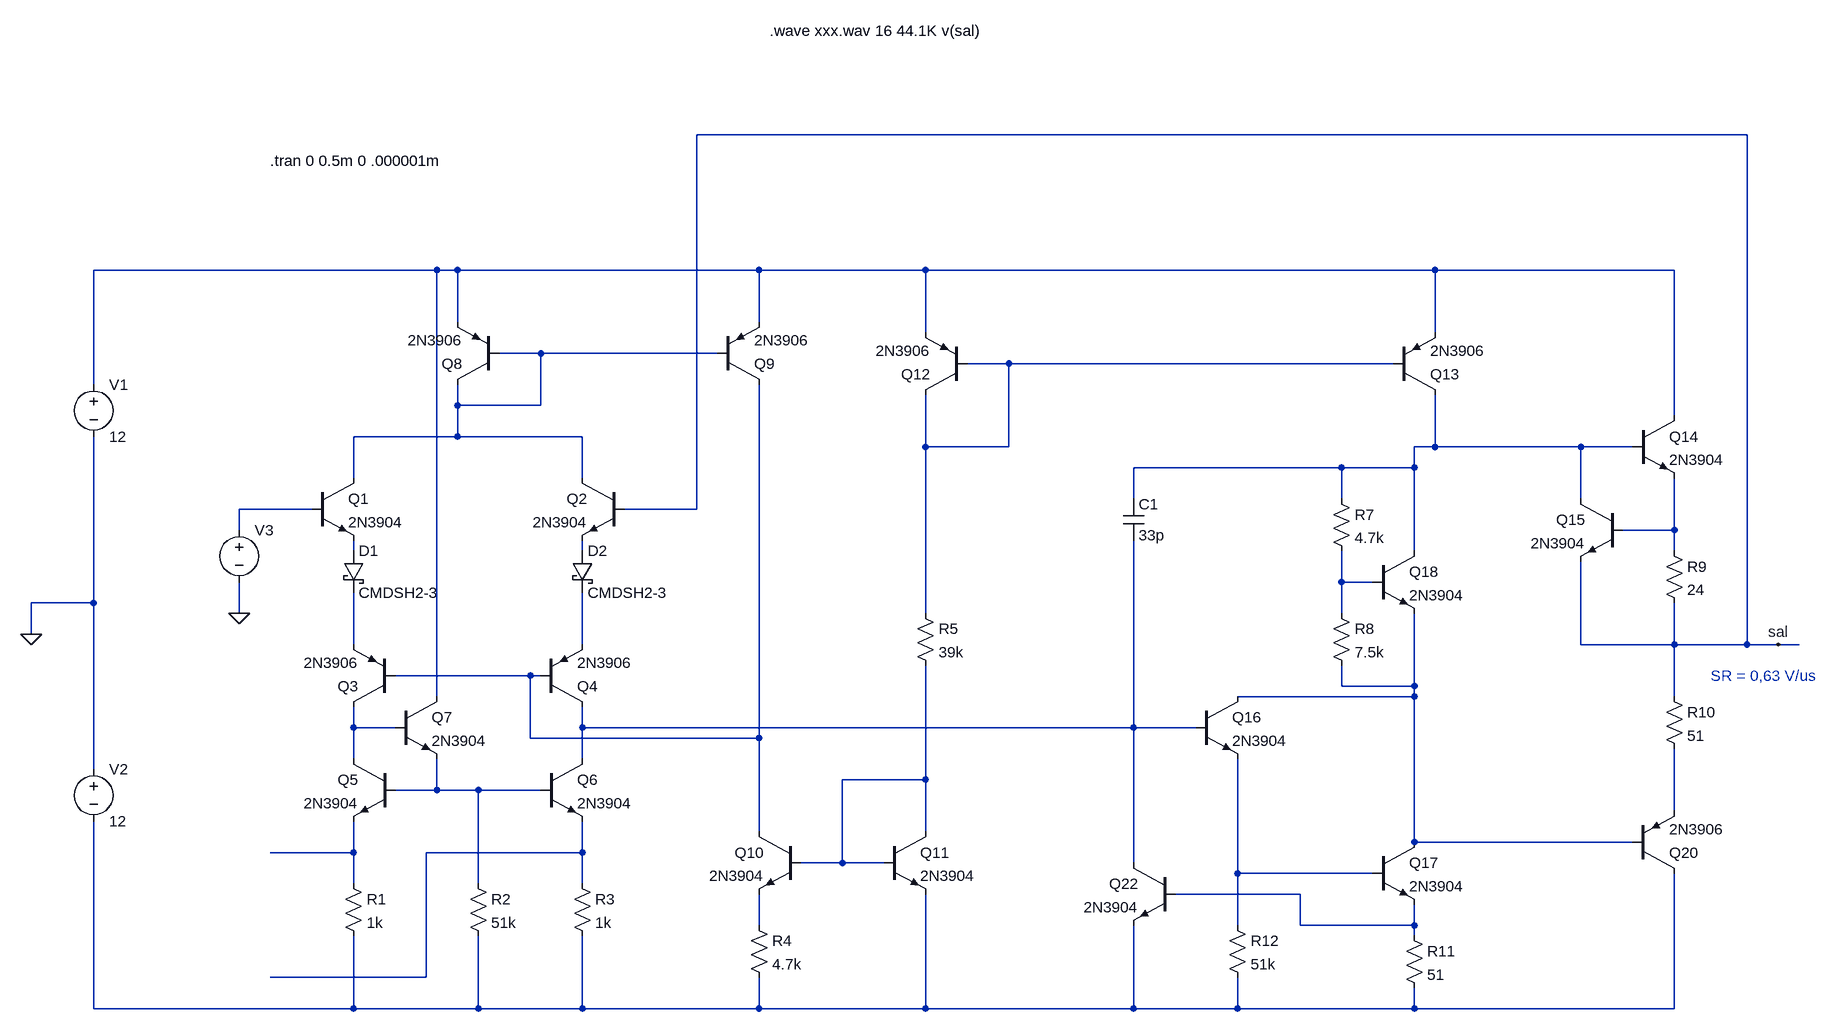
[diagram p0: schematic 741disc_sr.asc]
741disc_sr.asc, the LTspice schematic file:
Version 4
SHEET 1 2276 1496
WIRE 2144 -256 528 -256
WIRE 128 -48 -400 -48
WIRE 160 -48 128 -48
WIRE 624 -48 160 -48
WIRE 880 -48 624 -48
WIRE 1664 -48 880 -48
WIRE 2032 -48 1664 -48
WIRE 160 32 160 -48
WIRE 624 32 624 -48
WIRE 880 48 880 -48
WIRE 1664 48 1664 -48
WIRE 288 80 224 80
WIRE 560 80 288 80
WIRE 1008 96 944 96
WIRE 1600 96 1008 96
WIRE -400 128 -400 -48
WIRE 160 160 160 128
WIRE 288 160 288 80
WIRE 288 160 160 160
WIRE 2032 176 2032 -48
WIRE 160 208 160 160
WIRE 160 208 0 208
WIRE 352 208 160 208
WIRE 880 224 880 144
WIRE 1008 224 1008 96
WIRE 1008 224 880 224
WIRE 1664 224 1664 144
WIRE 1664 224 1632 224
WIRE 1888 224 1664 224
WIRE 1968 224 1888 224
WIRE 1520 256 1200 256
WIRE 1632 256 1632 224
WIRE 1632 256 1520 256
WIRE 0 272 0 208
WIRE 352 272 352 208
WIRE 1200 304 1200 256
WIRE 1520 304 1520 256
WIRE 1888 304 1888 224
WIRE -64 320 -176 320
WIRE 528 320 528 -256
WIRE 528 320 416 320
WIRE -176 352 -176 320
WIRE 2032 352 2032 272
WIRE 2032 352 1952 352
WIRE 0 384 0 368
WIRE 352 384 352 368
WIRE 1632 384 1632 256
WIRE 2032 384 2032 352
WIRE 1520 432 1520 384
WIRE 1568 432 1520 432
WIRE -400 464 -400 208
WIRE -400 464 -496 464
WIRE -176 480 -176 432
WIRE 880 480 880 224
WIRE 1520 480 1520 432
WIRE -496 512 -496 464
WIRE 0 528 0 448
WIRE 352 528 352 448
WIRE 1888 528 1888 400
WIRE 2032 528 2032 464
WIRE 2032 528 1888 528
WIRE 2144 528 2032 528
WIRE 2144 528 2144 -256
WIRE 2192 528 2144 528
WIRE 2224 528 2192 528
WIRE 272 576 64 576
WIRE 288 576 272 576
WIRE 1520 592 1520 560
WIRE 1632 592 1632 480
WIRE 1632 592 1520 592
WIRE 128 608 128 -48
WIRE 1632 608 1632 592
WIRE 1632 608 1360 608
WIRE 2032 608 2032 528
WIRE 0 656 0 624
WIRE 64 656 0 656
WIRE 352 656 352 624
WIRE 1200 656 1200 368
WIRE 1200 656 352 656
WIRE 1296 656 1200 656
WIRE 272 672 272 576
WIRE 624 672 624 128
WIRE 624 672 272 672
WIRE 0 704 0 656
WIRE 352 704 352 656
WIRE -400 720 -400 464
WIRE 880 736 880 560
WIRE 880 736 752 736
WIRE 128 752 128 704
WIRE 128 752 64 752
WIRE 192 752 128 752
WIRE 288 752 192 752
WIRE 2032 784 2032 688
WIRE 624 816 624 672
WIRE 880 816 880 736
WIRE 1632 832 1632 608
WIRE 1968 832 1632 832
WIRE 0 848 0 800
WIRE 0 848 -128 848
WIRE 352 848 352 800
WIRE 352 848 112 848
WIRE 752 864 752 736
WIRE 752 864 688 864
WIRE 816 864 752 864
WIRE 1200 864 1200 656
WIRE 1360 880 1360 704
WIRE 1568 880 1360 880
WIRE 0 896 0 848
WIRE 192 896 192 752
WIRE 352 896 352 848
WIRE 1456 912 1264 912
WIRE 624 960 624 912
WIRE 1360 960 1360 880
WIRE 1456 960 1456 912
WIRE 1632 960 1632 928
WIRE 1632 960 1456 960
WIRE 1632 976 1632 960
WIRE 112 1040 112 848
WIRE 112 1040 -128 1040
WIRE -400 1088 -400 800
WIRE 0 1088 0 976
WIRE 0 1088 -400 1088
WIRE 192 1088 192 976
WIRE 192 1088 0 1088
WIRE 352 1088 352 976
WIRE 352 1088 192 1088
WIRE 624 1088 624 1040
WIRE 624 1088 352 1088
WIRE 880 1088 880 912
WIRE 880 1088 624 1088
WIRE 1200 1088 1200 960
WIRE 1200 1088 880 1088
WIRE 1360 1088 1360 1040
WIRE 1360 1088 1200 1088
WIRE 1632 1088 1632 1056
WIRE 1632 1088 1360 1088
WIRE 2032 1088 2032 880
WIRE 2032 1088 1632 1088
FLAG -496 512 0
FLAG -176 480 0
FLAG 2192 528 sal
DATAFLAG 2096 528 ""
SYMBOL npn -64 272 R0
SYMATTR InstName Q1
SYMATTR Value 2N3904
SYMBOL schottky -16 384 R0
SYMATTR InstName D1
SYMATTR Value CMDSH2-3
SYMATTR Description Diode
SYMATTR Type diode
SYMBOL npn 416 272 M0
SYMATTR InstName Q2
SYMATTR Value 2N3904
SYMBOL schottky 336 384 R0
SYMATTR InstName D2
SYMATTR Value CMDSH2-3
SYMATTR Description Diode
SYMATTR Type diode
SYMBOL pnp 64 624 R180
SYMATTR InstName Q3
SYMATTR Value 2N3906
SYMBOL pnp 288 624 M180
SYMATTR InstName Q4
SYMATTR Value 2N3906
SYMBOL npn 64 704 M0
SYMATTR InstName Q5
SYMATTR Value 2N3904
SYMBOL npn 288 704 R0
SYMATTR InstName Q6
SYMATTR Value 2N3904
SYMBOL npn 64 608 R0
SYMATTR InstName Q7
SYMATTR Value 2N3904
SYMBOL pnp 224 128 R180
SYMATTR InstName Q8
SYMATTR Value 2N3906
SYMBOL res -16 880 R0
SYMATTR InstName R1
SYMATTR Value 1k
SYMBOL res 176 880 R0
SYMATTR InstName R2
SYMATTR Value 51k
SYMBOL res 336 880 R0
SYMATTR InstName R3
SYMATTR Value 1k
SYMBOL pnp 560 128 M180
SYMATTR InstName Q9
SYMATTR Value 2N3906
SYMBOL npn 688 816 M0
SYMATTR InstName Q10
SYMATTR Value 2N3904
SYMBOL res 608 944 R0
SYMATTR InstName R4
SYMATTR Value 4.7k
SYMBOL npn 816 816 R0
SYMATTR InstName Q11
SYMATTR Value 2N3904
SYMBOL res 864 464 R0
SYMATTR InstName R5
SYMATTR Value 39k
SYMBOL pnp 944 144 R180
SYMATTR InstName Q12
SYMATTR Value 2N3906
SYMBOL voltage -400 112 R0
WINDOW 123 0 0 Left 2
WINDOW 39 0 0 Left 2
SYMATTR InstName V1
SYMATTR Value 12
SYMBOL voltage -400 704 R0
WINDOW 123 0 0 Left 2
WINDOW 39 0 0 Left 2
SYMATTR InstName V2
SYMATTR Value 12
SYMBOL pnp 1600 144 M180
SYMATTR InstName Q13
SYMATTR Value 2N3906
SYMBOL npn 1968 176 R0
SYMATTR InstName Q14
SYMATTR Value 2N3904
SYMBOL npn 1952 304 M0
SYMATTR InstName Q15
SYMATTR Value 2N3904
SYMBOL npn 1296 608 R0
SYMATTR InstName Q16
SYMATTR Value 2N3904
SYMBOL npn 1568 832 R0
SYMATTR InstName Q17
SYMATTR Value 2N3904
SYMBOL npn 1568 384 R0
SYMATTR InstName Q18
SYMATTR Value 2N3904
SYMBOL pnp 1968 880 M180
SYMATTR InstName Q20
SYMATTR Value 2N3906
SYMBOL npn 1264 864 M0
SYMATTR InstName Q22
SYMATTR Value 2N3904
SYMBOL res 1504 288 R0
SYMATTR InstName R7
SYMATTR Value 4.7k
SYMBOL res 1504 464 R0
SYMATTR InstName R8
SYMATTR Value 7.5k
SYMBOL res 2016 368 R0
SYMATTR InstName R9
SYMATTR Value 24
SYMBOL res 2016 592 R0
SYMATTR InstName R10
SYMATTR Value 51
SYMBOL res 1616 960 R0
SYMATTR InstName R11
SYMATTR Value 51
SYMBOL res 1344 944 R0
SYMATTR InstName R12
SYMATTR Value 51k
SYMBOL cap 1184 304 R0
SYMATTR InstName C1
SYMATTR Value 33p
SYMBOL voltage -176 336 R0
WINDOW 3 24 96 Invisible 2
WINDOW 123 0 0 Left 2
WINDOW 39 0 0 Left 2
SYMATTR Value SINE(0 10 10k)
SYMATTR InstName V3
TEXT -128 -216 Left 2 !.tran 0 0.5m 0 .000001m
TEXT 2088 576 Left 2 ;SR = 0,63 V/us
TEXT 640 -416 Left 2 !.wave xxx.wav 16 44.1K v(sal)

The netlist it stands for:
* 741disc_sr.asc
Q1 N002 N005 N007 0 2N3904
D1 N007 N010 CMDSH2-3
Q2 N002 sal N008 0 2N3904
D2 N008 N011 CMDSH2-3
Q3 N014 N012 N010 0 2N3906
Q4 N015 N012 N011 0 2N3906
Q5 N014 N017 N019 0 2N3904
Q6 N015 N017 N020 0 2N3904
Q7 N001 N014 N017 0 2N3904
Q8 N002 N002 N001 0 2N3906
R1 N019 N024 1k
R2 N017 N024 51k
R3 N020 N024 1k
Q9 N012 N002 N001 0 2N3906
Q10 N012 N016 N023 0 2N3904
R4 N023 N024 4.7k
Q11 N016 N016 N024 0 2N3904
R5 N003 N016 39k
Q12 N003 N003 N001 0 2N3906
V1 N001 0 12
V2 0 N024 12
Q13 N004 N003 N001 0 2N3906
Q14 N001 N004 N006 0 2N3904
Q15 N004 N006 sal 0 2N3904
Q16 N013 N015 N021 0 2N3904
Q17 N013 N021 N022 0 2N3904
Q18 N004 N009 N013 0 2N3904
Q20 N024 N013 N018 0 2N3906
Q22 N015 N022 N024 0 2N3904
R7 N004 N009 4.7k
R8 N009 N013 7.5k
R9 N006 sal 24
R10 sal N018 51
R11 N022 N024 51
R12 N021 N024 51k
C1 N004 N015 33p
V3 N005 0 SINE(0 10 10k)
.model D D
.lib standard.dio
.model NPN NPN
.model PNP PNP
.lib standard.bjt
.tran 0 0.5m 0 .000001m
* SR = 0,63 V/us
.wave xxx.wav 16 44.1K v(sal)
.backanno
.end